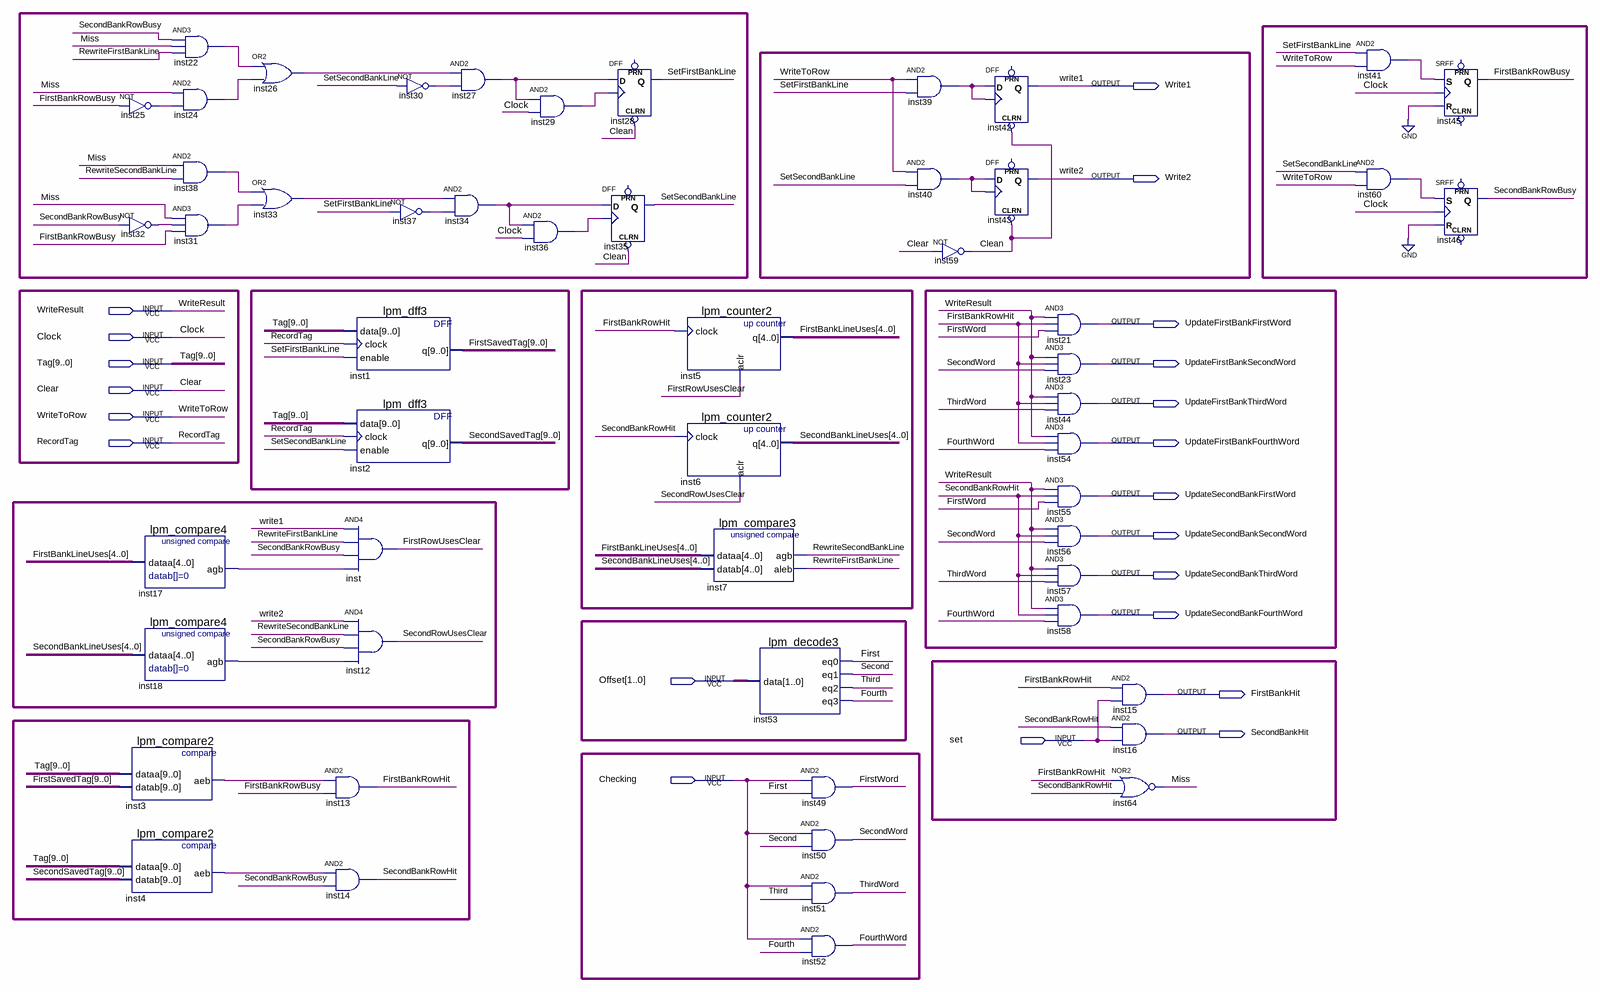
[diagram p0: schematic sheet]
// Quartus schematic LFUBlock.bdf as structural Verilog: 54 symbols, 21 pins
module LFUBlock (
  input  WriteResult,
  input  Clock,
  input  [9:0] Tag,
  input  Clear,
  input  WriteToRow,
  input  RecordTag,
  input  [1:0] Offset,
  input  set,
  input  Checking,
  output Write1,
  output Write2,
  output UpdateFirstBankFirstWord,
  output UpdateFirstBankSecondWord,
  output UpdateFirstBankThirdWord,
  output UpdateFirstBankFourthWord,
  output UpdateSecondBankFirstWord,
  output UpdateSecondBankSecondWord,
  output UpdateSecondBankThirdWord,
  output UpdateSecondBankFourthWord,
  output FirstBankHit,
  output SecondBankHit
);

  wire Clean, First, FirstBankRowBusy, FirstBankRowHit, FirstRowUsesClear, FirstWord, Fourth, FourthWord,
       inst3_aeb, inst4_aeb, inst17_agb, inst18_agb, inst22_out, inst24_out, inst25_out, inst26_out,
       inst27_out, inst29_out, inst30_out, inst31_out, inst32_out, inst33_out, inst34_out, inst36_out,
       inst37_out, inst38_out, inst39_out, inst40_out, inst41_out, inst60_out, Miss, RewriteFirstBankLine,
       RewriteSecondBankLine, Second, SecondBankRowBusy, SecondBankRowHit, SecondRowUsesClear, SecondWord,
       SetFirstBankLine, SetSecondBankLine, Third, ThirdWord;
  wire [4:0] FirstBankLineUses, SecondBankLineUses;
  wire [9:0] FirstSavedTag, SecondSavedTag;

  not inst25 (inst25_out, FirstBankRowBusy);
  not inst32 (inst32_out, SecondBankRowBusy);
  lpm_compare4 inst17 (.dataa(FirstBankLineUses), .agb(inst17_agb));
  lpm_compare4 inst18 (.dataa(SecondBankLineUses), .agb(inst18_agb));
  lpm_compare2 inst3 (.dataa(Tag), .datab(FirstSavedTag), .aeb(inst3_aeb));
  lpm_compare2 inst4 (.dataa(Tag), .datab(SecondSavedTag), .aeb(inst4_aeb));
  and inst22 (inst22_out, SecondBankRowBusy, Miss, RewriteFirstBankLine);
  and inst24 (inst24_out, Miss, inst25_out);
  and inst38 (inst38_out, Miss, RewriteSecondBankLine);
  and inst31 (inst31_out, Miss, inst32_out, FirstBankRowBusy);
  or inst26 (inst26_out, inst22_out, inst24_out);
  or inst33 (inst33_out, inst38_out, inst31_out);
  lpm_dff3 inst1 (.data(Tag), .clock(RecordTag), .enable(SetFirstBankLine), .q(FirstSavedTag));
  lpm_dff3 inst2 (.data(Tag), .clock(RecordTag), .enable(SetSecondBankLine), .q(SecondSavedTag));
  and inst (FirstRowUsesClear, Write1, RewriteFirstBankLine, SecondBankRowBusy, inst17_agb);
  and inst12 (SecondRowUsesClear, Write2, RewriteSecondBankLine, SecondBankRowBusy, inst18_agb);
  and inst13 (FirstBankRowHit, inst3_aeb, FirstBankRowBusy);
  and inst14 (SecondBankRowHit, inst4_aeb, SecondBankRowBusy);
  not inst30 (inst30_out, SetSecondBankLine);
  not inst37 (inst37_out, SetFirstBankLine);
  and inst27 (inst27_out, inst26_out, inst30_out);
  and inst34 (inst34_out, inst33_out, inst37_out);
  and inst29 (inst29_out, inst27_out, Clock);
  and inst36 (inst36_out, inst34_out, Clock);
  DFF inst28 (.CLRN(Clean), .CLK(inst29_out), .D(inst27_out), .Q(SetFirstBankLine));  // open: PRN
  DFF inst35 (.CLRN(Clean), .CLK(inst36_out), .D(inst34_out), .Q(SetSecondBankLine));  // open: PRN
  lpm_counter2 inst5 (.clock(FirstBankRowHit), .aclr(FirstRowUsesClear), .q(FirstBankLineUses));
  lpm_counter2 inst6 (.clock(SecondBankRowHit), .aclr(SecondRowUsesClear), .q(SecondBankLineUses));
  lpm_compare3 inst7 (
    .dataa(FirstBankLineUses), .datab(SecondBankLineUses), .agb(RewriteSecondBankLine),
    .aleb(RewriteFirstBankLine));
  lpm_decode3 inst53 (.data(Offset), .eq0(First), .eq1(Second), .eq2(Third), .eq3(Fourth));
  and inst49 (FirstWord, Checking, First);
  and inst50 (SecondWord, Checking, Second);
  and inst51 (ThirdWord, Checking, Third);
  and inst52 (FourthWord, Checking, Fourth);
  and inst39 (inst39_out, WriteToRow, SetFirstBankLine);
  and inst40 (inst40_out, WriteToRow, SetSecondBankLine);
  not inst59 (Clean, Clear);
  DFF inst42 (.CLRN(Clean), .CLK(inst39_out), .D(inst39_out), .Q(Write1));  // open: PRN
  DFF inst43 (.CLRN(Clean), .CLK(inst40_out), .D(inst40_out), .Q(Write2));  // open: PRN
  and inst21 (UpdateFirstBankFirstWord, WriteResult, FirstBankRowHit, FirstWord);
  and inst23 (UpdateFirstBankSecondWord, WriteResult, FirstBankRowHit, SecondWord);
  and inst44 (UpdateFirstBankThirdWord, WriteResult, FirstBankRowHit, ThirdWord);
  and inst54 (UpdateFirstBankFourthWord, WriteResult, FirstBankRowHit, FourthWord);
  and inst55 (UpdateSecondBankFirstWord, WriteResult, SecondBankRowHit, FirstWord);
  and inst56 (UpdateSecondBankSecondWord, WriteResult, SecondBankRowHit, SecondWord);
  and inst57 (UpdateSecondBankThirdWord, WriteResult, SecondBankRowHit, ThirdWord);
  and inst58 (UpdateSecondBankFourthWord, WriteResult, SecondBankRowHit, FourthWord);
  and inst15 (FirstBankHit, FirstBankRowHit, set);
  and inst16 (SecondBankHit, SecondBankRowHit, set);
  nor inst64 (Miss, FirstBankRowHit, SecondBankRowHit);
  and inst41 (inst41_out, SetFirstBankLine, WriteToRow);
  and inst60 (inst60_out, SetSecondBankLine, WriteToRow);
  SRFF inst45 (.S(inst41_out), .R(1'b0), .CLK(Clock), .Q(FirstBankRowBusy));  // open: PRN, CLRN
  SRFF inst46 (.S(inst60_out), .R(1'b0), .CLK(Clock), .Q(SecondBankRowBusy));  // open: PRN, CLRN
endmodule
